# EAGLE design dcfusb-002 (EAGLE 6.5.0)
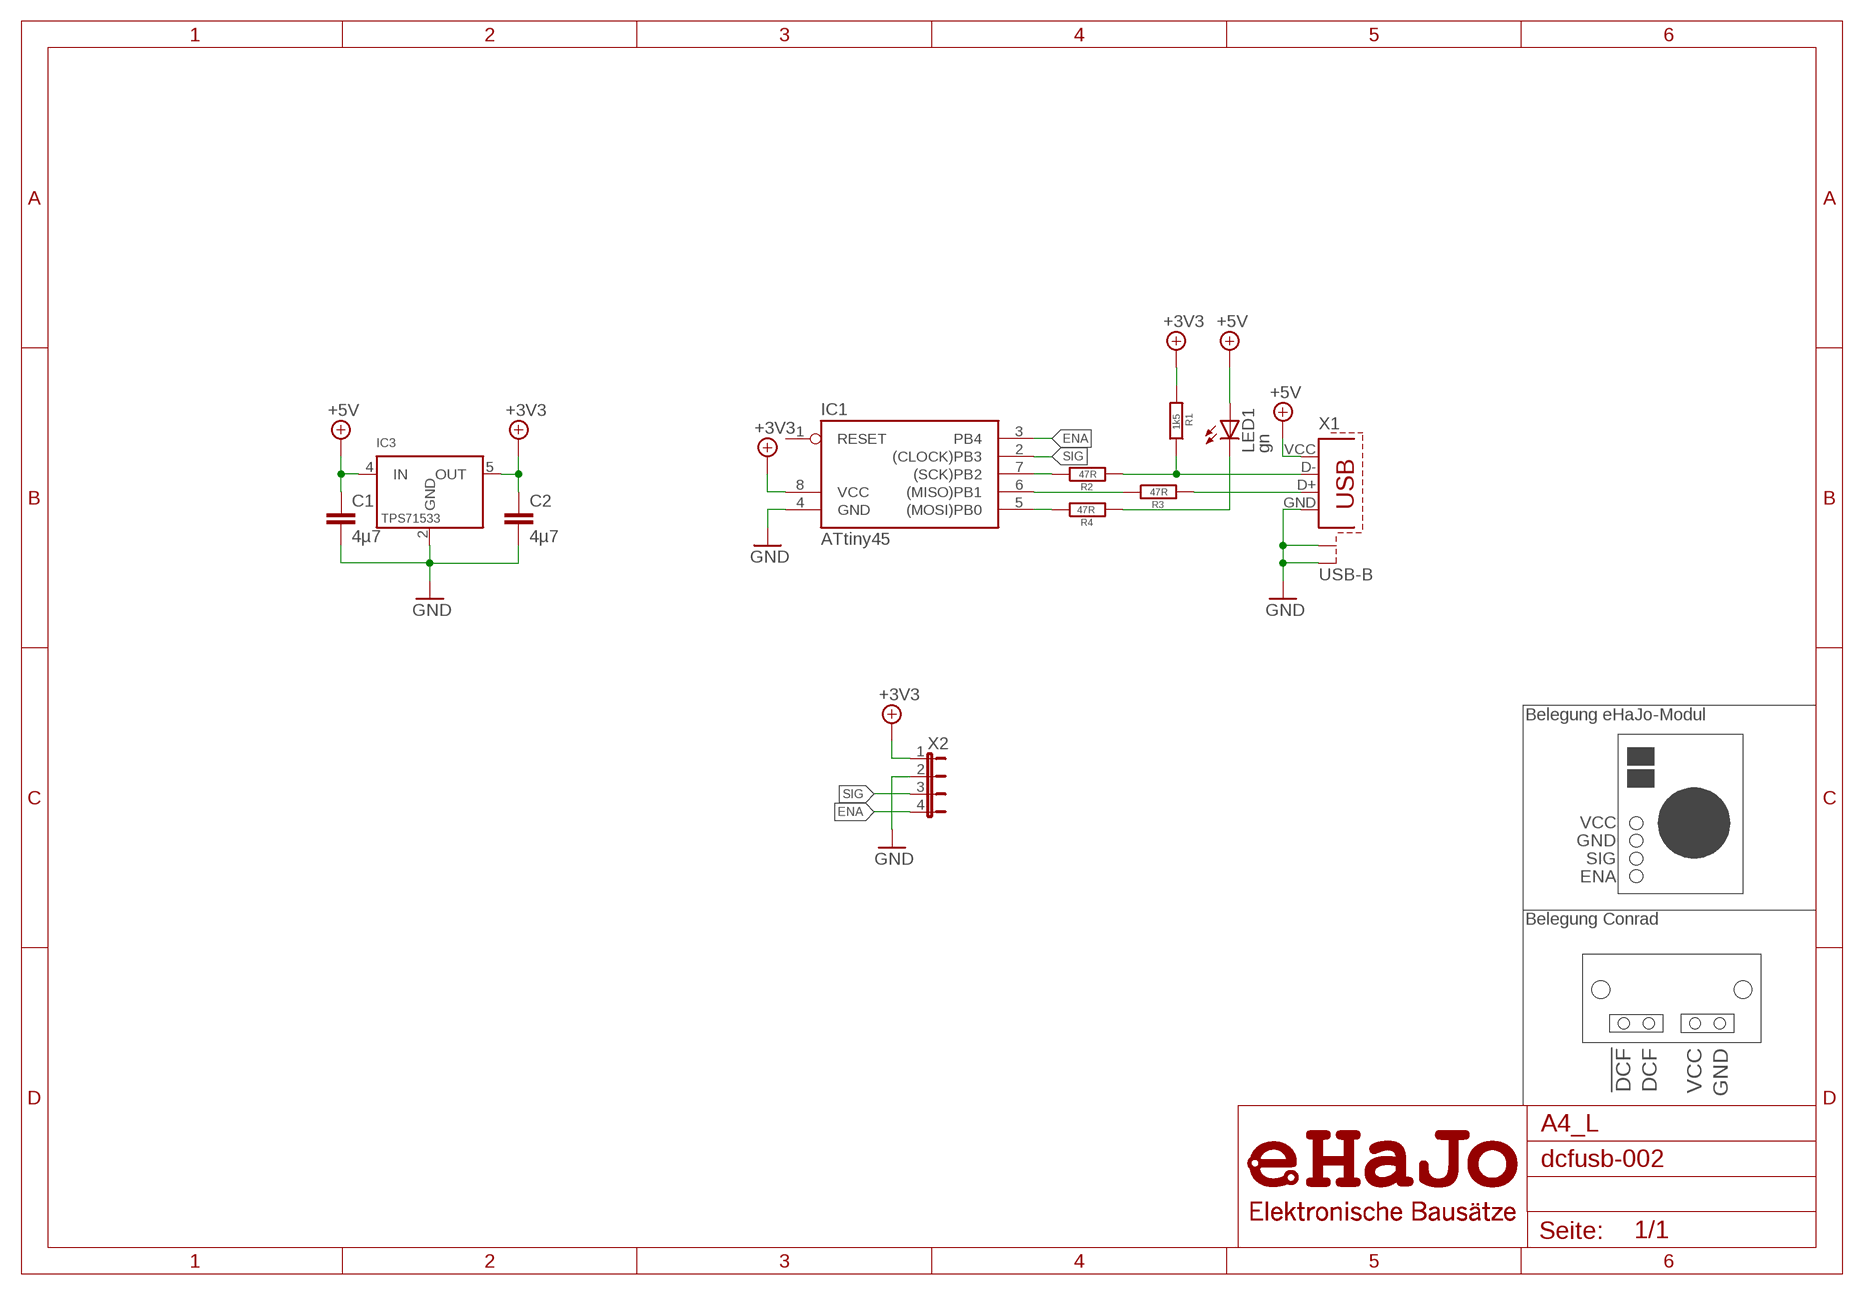
[diagram p0: schematic, sheet 1]

## Parts
C1  4µ7  CC0805  [C0805]
C2  4µ7  CC0805  [C0805]
IC1  ATtiny45  TINY22S  [SOIC8]
IC3  TPS71533  [SOT23-DCK]
LED1  gn  LEDCHIP-LED0805  [CHIP-LED0805]
R1  1k5  RR0805  [R0805]
R2  47R  RR0805  [R0805]
R3  47R  RR0805  [R0805]
R4  47R  RR0805  [R0805]
X1  USB-B  [PN61729-S]
X2  JP4E  [JP4]

## Nets
+3V3: C2.1 IC1.8(VCC) IC3.5(OUT) R1.2 X2.1
+5V: C1.1 IC3.4(IN) LED1.A X1.VCC
ENA: IC1.3(PB4) X2.4
GND: C1.2 C2.2 IC1.4(GND) IC3.2(GND) X1.GND X1.S1 X1.S2 X2.2
N$1: IC1.7((SCK)PB2) R2.1
N$2: IC1.6((MISO)PB1) R3.1
N$3: IC1.5((MOSI)PB0) R4.1
N$4: LED1.C R4.2
N$5: R1.1 R2.2 X1.D-
N$6: R3.2 X1.D+
SIG: IC1.2((CLOCK)PB3) X2.3
Unconnected: IC1.1(RESET)

## Notes on the sheet
- Belegung eHaJo-Modul
- VCC
  GND
  SIG
  ENA
- Belegung Conrad
- !DCF | DCF | VCC | GND

## Library data of the parts
C1 C2 = rcl:C: CAPACITOR, European symbol
IC1 = atmel:TINY22: MICROCONTROLLER 1K ROM 128 bytes RAM 128 bytes EEPROM
IC3 = texas:TPS71533
LED1 = led:LED: LED OSRAM: - CHIPLED LG R971, LG N971, LY N971, LG Q971, LY Q971, LO R971, LY R971 LH N974, LH R974 LS Q976, LO Q976, LY Q976 LO Q996 - Hyper CHIPLED LW Q18S LB Q993, LB Q99A, LB R99A - SideLED LS A670, LO A670, LY A670, LG A670, LP A670 LB A673, LV A673, LT A673, LW A673 LH A674 LY A675 LS A676, LA A676, LO A676, LY A676, LW A676 LS A679, LY A679, LG A679 - Hyper Micro SIDELED® LS Y876, LA Y876, LO Y876, LY Y876 LT Y87S - SmartLED LW L88C, LW L88S LB L89C, LB L89S, LG L890 LS L89K, LO L89K, LY L89K LS L896, LA L896, LO L896, LY L896 - TOPLED LS T670, LO T670, LY T670, LG T670, LP T670 LSG T670, LSP T670, LSY T670, LOP T670, LYG T670 LG T671, LOG T671, LSG T671 LB T673, LV T673, LT T673, LW T673 LH T674 LS T676, LA T676, LO T676, LY T676, LB T676, LH T676, LSB T676, LW T676 LB T67C, LV T67C, LT T67C, LS T67K, LO T67K, LY T67K, LW E67C LS E67B, LA E67B, LO E67B, LY E67B, LB E67C, LV E67C, LT E67C LW T67C LS T679, LY T679, LG T679 LS T770, LO T770, LY T770, LG T770, LP T770 LB T773, LV T773, LT T773, LW T773 LH T774 LS E675, LA E675, LY E675, LS T675 LS T776, LA T776, LO T776, LY T776, LB T776 LHGB T686 LT T68C, LB T68C - Hyper Mini TOPLED® LB M676 - Mini TOPLED Santana® LG M470 LS M47K, LO M47K, LY M47K Source: http://www.osram.convergy.de LUXEON: - LUMILED® LXK2-PW12-R00, LXK2-PW12-S00, LXK2-PW14-U00, LXK2-PW14-V00 LXK2-PM12-R00, LXK2-PM12-S00, LXK2-PM14-U00 LXK2-PE12-Q00, LXK2-PE12-R00, LXK2-PE12-S00, LXK2-PE14-T00, LXK2-PE14-U00 LXK2-PB12-K00, LXK2-PB12-L00, LXK2-PB12-M00, LXK2-PB14-N00, LXK2-PB14-P00, LXK2-PB14-Q00 LXK2-PR12-L00, LXK2-PR12-M00, LXK2-PR14-Q00, LXK2-PR14-R00 LXK2-PD12-Q00, LXK2-PD12-R00, LXK2-PD12-S00 LXK2-PH12-R00, LXK2-PH12-S00 LXK2-PL12-P00, LXK2-PL12-Q00, LXK2-PL12-R00 Source: www.luxeon.com KINGBRIGHT: KA-3528ASYC Source: www.kingbright.com
R1-R4 = rcl:R: RESISTOR, European symbol
X1 = connectors:USB-B: BERG USB connector
X2 = jumper:JP4E: JUMPER

## Board
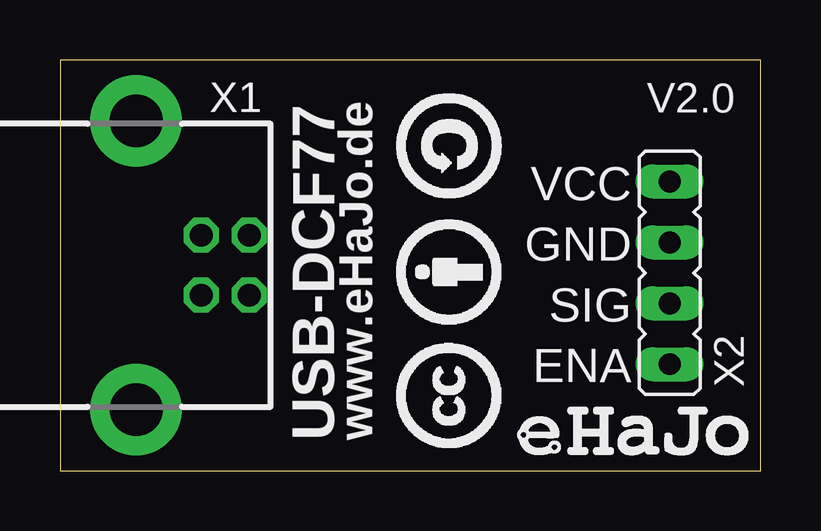
[diagram p1: board, top side]
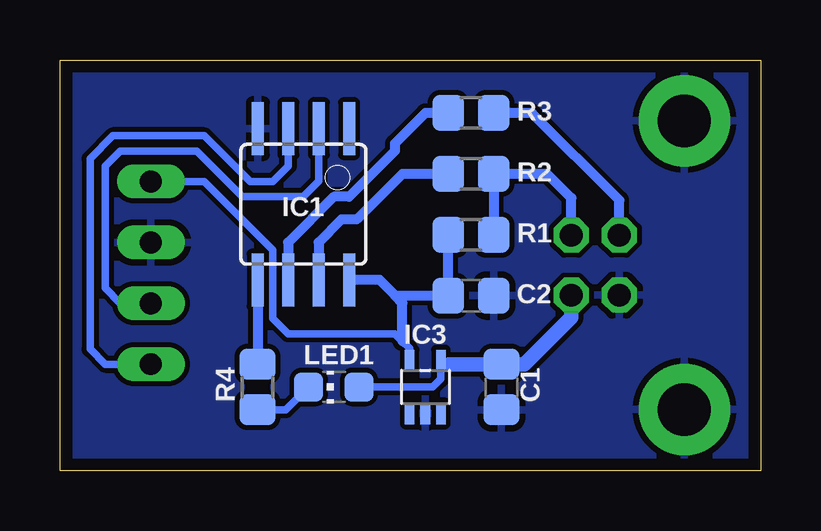
[diagram p2: board, bottom side, seen from below]

Size 29.19 x 17.13 mm. Coordinates in mm from the lower left corner, seen from the top.
Outline: 0,0 29.19,0 29.19,17.13 0,17.13 0,0
Copper layers 16: Bottom 0.035mm
Design rules "default *": minimum track width 10mil, minimum drill 24mil, track to track 8mil, track to pad 8mil, pad to pad 8mil, via to via 8mil, smd to smd 8mil, copper to edge 20mil, drill to drill 10mil, minimum pad ring 10mil, minimum via ring 8mil, stop-mask expansion 4mil, vias tented up to drill 0mil, thermal gap 10mil

### Footprints (pad centres in the part's own frame; a part is rotated, then mirrored left to right if it is on the bottom)
C0805 = smd 1.3 x 1.5: 1 -0.95,0; 2 0.95,0
SOIC8 = smd 0.5 x 2.2: 1 -1.905,-3.154; 2 -0.645,-3.154; 3 0.625,-3.154; 4 1.895,-3.154; 5 1.905,3.154; 6 0.635,3.154; 7 -0.635,3.154; 8 -1.905,3.154
SOT23-DCK = smd 0.4 x 0.9: 1 -0.65,-1.1; 2 0,-1.1; 3 0.65,-1.1; 4 0.65,1.1; 5 -0.65,1.1
CHIP-LED0805 = smd 1.2 x 1.2: A 0,-1.05; C 0,1.05
R0805 = smd 1.3 x 1.5: 1 -0.95,0; 2 0.95,0
PN61729-S = drill 0.95 octagon: D+ -1.25,2.71; D- -1.25,4.71; GND 1.25,2.71; VCC 1.25,4.71 | drill 2.2 pad 3.81: S1 -6.02,0; S2 6.02,0
JP4 = drill 0.914 long: 1 -3.81,0; 2 -1.27,0; 3 1.27,0; 4 3.81,0

### Placement (x,y rotation side)
C1  10.79,3.49 270 bottom
C2  12.06,7.3 0 bottom
IC1  19.05,11.11 180 bottom
IC3  13.97,3.49 0 bottom
LED1  17.78,3.49 90 bottom
R1  12.06,9.84 180 bottom
R2  12.06,12.38 0 bottom
R3  12.06,14.92 0 bottom
R4  20.95,3.49 270 bottom
X1  3.17,8.57 270 top
X2  25.4,8.26 270 top

### Tracks (layer width: path | path; a pad name or v marks a point on that pad's centre or on a via)
+3V3
  Bottom 0.305: IC3.5 14.62,5.1 14.92,5.4 15.24,5.71 19.68,5.71 20.32,6.35 20.32,9.21 23.18,12.06 X2.1
  Bottom 0.406: R1.2 C2.1 15.22,7.3 | 15.22,7.3 15.24,7.3 14.92,6.98 14.92,5.4 | 15.22,7.3 15.88,7.96 IC1.8
+5V
  Bottom 0.305: LED1.A 13.65,3.49 13.32,3.83 IC3.4 13.17,4.44 12.7,4.44
  Bottom 0.61: X1.VCC 7.88,6.4 9.85,4.44 C1.1 12.7,4.44 12.99,4.44
ENA
  Bottom 0.305: IC1.3 19.68,12.71 20.32,12.06 21.27,12.06 23.18,13.97 26.99,13.97 27.94,13.02 27.94,5.08 27.3,4.45 X2.4
GND
  pour Bottom: 0,0 0,17.14 29.21,17.14 29.21,0
N$1
  Bottom 0.406: R2.1 14.92,12.38 16.83,10.48 17.46,10.48 18.41,9.53 IC1.7
N$2
  Bottom 0.406: R3.1 13.97,14.92 15.24,13.65 15.24,13.34 17.14,11.43 17.78,11.43 19.68,9.53 IC1.6
N$3
  Bottom 0.406: IC1.5 R4.1
N$4
  Bottom 0.305: LED1.C 19.78,2.54 R4.2
N$5
  Bottom 0.406: X1.D- 7.88,11.38 8.89,12.38 R2.2 R1.1
N$6
  Bottom 0.406: X1.D+ 5.88,11.28 9.53,14.92 R3.2
SIG
  Bottom 0.305: IC1.2 18.41,12.07 19.05,11.43 21.59,11.43 23.5,13.34 26.67,13.34 27.3,12.7 27.3,7.62 26.67,6.99 X2.3

### Text on the board
tPlace: V2.0 | VCC / GND / SIG / ENA | USB-DCF77 | www.eHaJo.de